# Altium schematic sheet RGB_Display.SchDoc: Ixora
size A3; Organization: Toradex AG; Address1: Altsagenstrasse 5; Address2: Horw; Address3: 6048; Address4: Switzerland; DocumentNumber: 12; Revision: V1.1; SheetNumber: 11; SheetTotal: 17; PageSetup: Record=PageOptions|CenterHorizontal=True|CenterVertical=True|PrintScale=0.73|XCorrection=1.00|YCorrection=1.00|PrintKind=0|BorderSize=5000000|LeftOffset=0|BottomOffset=0|Orientation=2|PaperLength=1000|PaperWidth=1000|Scale=100|PaperSource=7|PrintQuality=-4|MediaType=1|DitherType=10|PaperKind=A4|PrintScaleMode=1
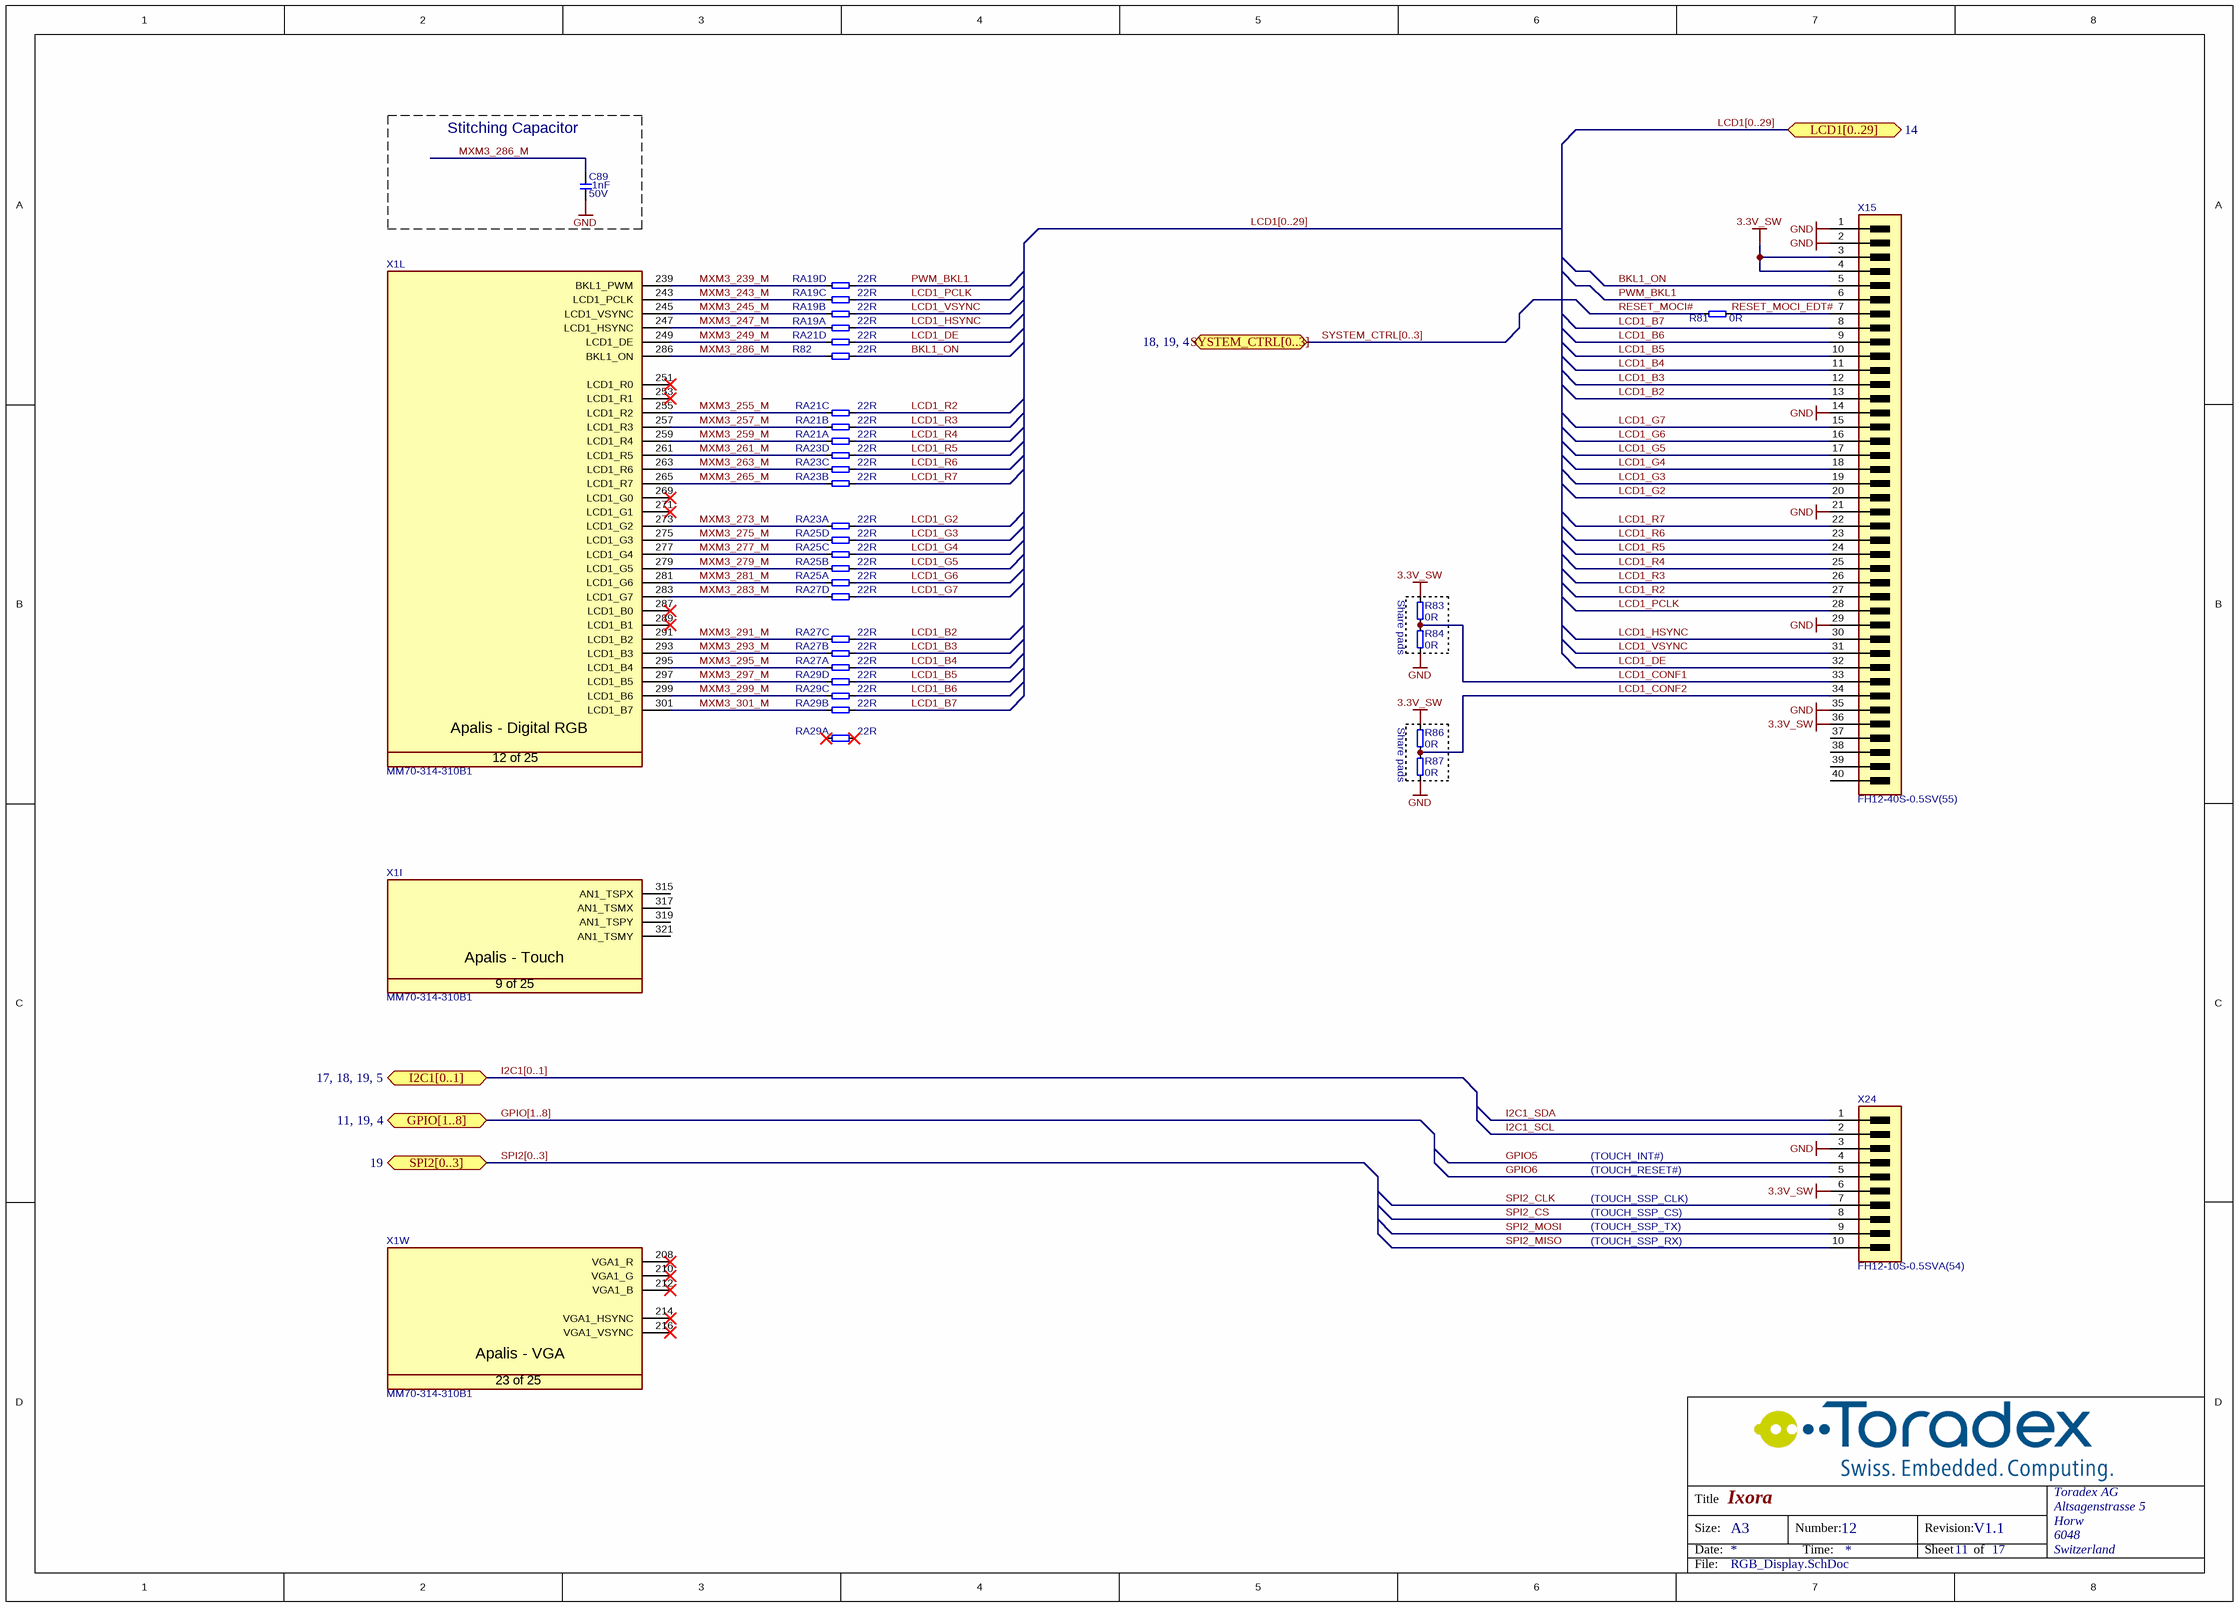
[diagram p0: RGB_Display.SchDoc]

## Parts
C89  Rating: 50V  [CAPC1005X60N]  (hidden comment: 1nF)
R81  0R  [RESC1005X40N]
R82  22R  [RESC1005X40N]
R83  0R  [T_RESC0603X30N]
R84  0R  [T_RESC0603X30N]
R86  0R  [T_RESC0603X30N]
R87  0R  [T_RESC0603X30N]
RA19  22R  [T_Resistor_Array_X4]  (parts A,B,C,D of 4)
RA21  22R  [T_Resistor_Array_X4]  (parts A,B,C,D of 4)
RA23  22R  [T_Resistor_Array_X4]  (parts A,B,C,D of 4)
RA25  22R  [T_Resistor_Array_X4]  (parts A,B,C,D of 4)
RA27  22R  [T_Resistor_Array_X4]  (parts A,B,C,D of 4)
RA29  22R  [T_Resistor_Array_X4]  (parts A,B,C,D of 4)
X1  Manufacturer Part No.: MM70-314-310B1  [T_JAE_MM70-314-310B1]  (hidden comment: CON-JAE-MM70-314-310B1-314-0.5mm)  (parts I,L,W of 25)
X15  FH12-40S-0.5SV(55)  [T_Hirose_FH12-40S-0.5SV(55)]
X24  FH12-10S-0.5SVA(54)  [T_Hirose_FH12-10S-0.5SVA(54)]

## Blocks framed on the sheet
Stitching Capacitor: C89

## Ports
GPIO[1..8] (bidir, see 11, 19, 4), I2C1[0..1] (bidir, see 17, 18, 19, 5), LCD1[0..29] (bidir, see 14), SPI2[0..3] (bidir, see 19), SYSTEM_CTRL[0..3] (bidir, see 18, 19, 4)

## Nets
3.3V_SW: R83.1 R86.1 X15.3(VCC) X15.4(VCC) X15.36(VDD) X24.6(TMDS_DATA0_N)
GND: C89.1 R84.2 R87.1 X15.1(VSS) X15.2(VSS) X15.14(VSS) X15.21(VSS) X15.29(VSS) X15.35(VSS) X24.3(TMDS_CLK_N)
BKL1_ON: R82.2 X15.5(PWCTRL)
GPIO5: X24.4(GND)
GPIO6: X24.5(TMDS_DATA0_P)
I2C1_SCL: X24.2(TMDS_CLK_P)
I2C1_SDA: X24.1(GND)
LCD1_B2: RA27.7 X15.13(B0)
LCD1_B3: RA27.6 X15.12(B1)
LCD1_B4: RA27.5 X15.11(B2)
LCD1_B5: RA29.8 X15.10(B3)
LCD1_B6: RA29.7 X15.9(B4)
LCD1_B7: RA29.6 X15.8(B5)
LCD1_CONF1: R83.2 R84.1 X15.33(NC)
LCD1_CONF2: R86.2 R87.2 X15.34(SHUT)
LCD1_DE: RA21.8 X15.32(ENB)
LCD1_G2: RA23.5 X15.20(G0)
LCD1_G3: RA25.8 X15.19(G1)
LCD1_G4: RA25.7 X15.18(G2)
LCD1_G5: RA25.6 X15.17(G3)
LCD1_G6: RA25.5 X15.16(G4)
LCD1_G7: RA27.8 X15.15(G5)
LCD1_HSYNC: RA19.5 X15.30(HSYNC)
LCD1_PCLK: RA19.7 X15.28(DCLK)
LCD1_R2: RA21.7 X15.27(R0)
LCD1_R3: RA21.6 X15.26(R1)
LCD1_R4: RA21.5 X15.25(R2)
LCD1_R5: RA23.8 X15.24(R3)
LCD1_R6: RA23.7 X15.23(R4)
LCD1_R7: RA23.6 X15.22(R5)
LCD1_VSYNC: RA19.6 X15.31(VSYNC)
MXM3_239_M: RA19.4 X1.239(BKL1_PWM)
MXM3_243_M: RA19.3 X1.243(LCD1_PCLK)
MXM3_245_M: RA19.2 X1.245(LCD1_VSYNC)
MXM3_247_M: RA19.1 X1.247(LCD1_HSYNC)
MXM3_249_M: RA21.4 X1.249(LCD1_DE)
MXM3_255_M: RA21.3 X1.255(LCD1_R2)
MXM3_257_M: RA21.2 X1.257(LCD1_R3)
MXM3_259_M: RA21.1 X1.259(LCD1_R4)
MXM3_261_M: RA23.4 X1.261(LCD1_R5)
MXM3_263_M: RA23.3 X1.263(LCD1_R6)
MXM3_265_M: RA23.2 X1.265(LCD1_R7)
MXM3_273_M: RA23.1 X1.273(LCD1_G2)
MXM3_275_M: RA25.4 X1.275(LCD1_G3)
MXM3_277_M: RA25.3 X1.277(LCD1_G4)
MXM3_279_M: RA25.2 X1.279(LCD1_G5)
MXM3_281_M: RA25.1 X1.281(LCD1_G6)
MXM3_283_M: RA27.4 X1.283(LCD1_G7)
MXM3_286_M: C89.2 R82.1 X1.286(BKL1_ON)
MXM3_291_M: RA27.3 X1.291(LCD1_B2)
MXM3_293_M: RA27.2 X1.293(LCD1_B3)
MXM3_295_M: RA27.1 X1.295(LCD1_B4)
MXM3_297_M: RA29.4 X1.297(LCD1_B5)
MXM3_299_M: RA29.3 X1.299(LCD1_B6)
MXM3_301_M: RA29.2 X1.301(LCD1_B7)
PWM_BKL1: RA19.8 X15.6(LEDCTRL)
RESET_MOCI#: R81.1
RESET_MOCI_EDT#: R81.2 X15.7(RESET#)
SPI2_CLK: X24.7(GND)
SPI2_CS: X24.8(TMDS_DATA1_P)
SPI2_MISO: X24.10(GND)
SPI2_MOSI: X24.9(TMDS_DATA1_N)

Not connected (* = marked no-connect by the designer): RA29 1* 5*; X1 208(VGA1_R)* 210(VGA1_G)* 212(VGA1_B)* 214(VGA1_HSYNC)* 216(VGA1_VSYNC)* 251(LCD1_R0)* 253(LCD1_R1)* 269(LCD1_G0)* 271(LCD1_G1)* 287(LCD1_B0)* 289(LCD1_B1)* 315(AN1_TSPX) 317(AN1_TSMX) 319(AN1_TSPY) 321(AN1_TSMY); X15 37(YU) 38(XR) 39(YD) 40(XL)

## Buses and harness runs
bus GPIO[1..8] = port GPIO[1..8]
bus I2C1[0..1] = port I2C1[0..1]
bus LCD1[0..29] = port LCD1[0..29]
bus SPI2[0..3] = port SPI2[0..3]
bus SYSTEM_CTRL[0..3] = port SYSTEM_CTRL[0..3]

## Notes on the sheet
- Share pads
- (TOUCH_INT#)
- (TOUCH_RESET#)
- (TOUCH_SSP_CLK)
- (TOUCH_SSP_CS)
- (TOUCH_SSP_TX)
- (TOUCH_SSP_RX)
- Title
- Size:
- Date:
- A3
- Number:
- Time:
- Revision:
- Sheet
- of
- File:
- (in symbol CON-JAE-MM70-314-310B1-314-0.5mm, part I) Apalis - Touch; 9 of 25
- (in symbol CON-JAE-MM70-314-310B1-314-0.5mm, part L) Apalis - Digital RGB; 12 of 25
- (in symbol CON-JAE-MM70-314-310B1-314-0.5mm, part W) Apalis - VGA; 23 of 25

## Library data of the parts
C89 = C-X7R-1nF-50V-10%-0402: Capacitor Ceramic X7R 1nF 50V 10% 0402; Tolerance: 10%; Type: X7R; Value: 1nF
R81 = R-0R-63mW-1%-0402: Resistor 0 ohm 63mW 1% 0402; Rating: 63mW; Tolerance: 1%; Value: 0R
R82 = R-22R-63mW-5%-0402: Resistor 22 ohm 63mW 5% 0402; Rating: 63mW; Tolerance: 5%; Value: 22R
R83 R84 R86 R87 = R-0R-63mW-1%-0603: Resistor 0 ohm 63mW 1% 0603; Rating: 63mW; Tolerance: 1%; Value: 0R
RA19 RA21 RA23 RA25 RA27 RA29 = RA-22R-63mW-5%-1206-div: Resistor Array 22 R 63mW 5% 1206; Tolerance: 5%; Power Dissipation: 63mW; Value: 22R
X1 = CON-JAE-MM70-314-310B1-314-0.5mm: MXM3 Connector; Manufacturer Name: JAE; No. of ways: 314
X15 = CON-Hirose-FH12-40S-0.5SV(55)-0.5mm: 0.50mm Pitch FFC/FPC Vertical RGB connector; Manufacturer Name: Hirose; No. of ways: 24; Pitch: 0.5mm; Manufacturer Part No.: FH12-40S-0.5SV(55)
X24 = CON-Hirose-FH12-10S-0.5SVA(54)-0.5mm: FFC/FPC, 1 Sided Contact, 0.50mm Pitch, 10 pins; Manufacturer Name: Hirose; No. of ways: 10; Pitch: 0.5mm; Manufacturer Part No.: FH12-10S-0.5SVA(54)